# Altium project DCAR_Adapter.PrjPcb
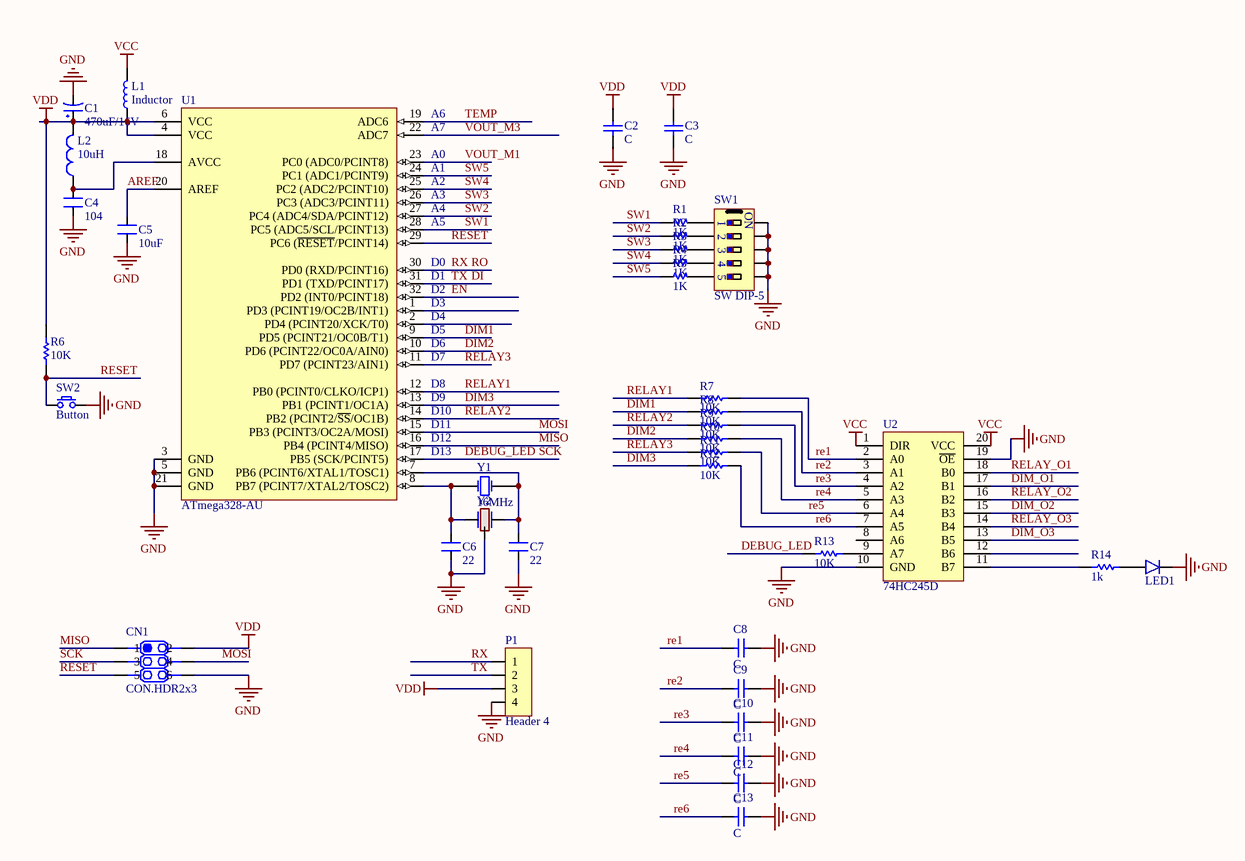
[diagram p0: Sheet2.SchDoc]
4 sheets, 133 parts. Net scope: global (net labels, ports and power ports of the same name join across sheets).
Board file: PCB2.PcbDoc
Sheets:
  Sheet2.SchDoc
  Sheet3.SchDoc
  Sheet4.SchDoc
  Sheet5.SchDoc

## Sheet Sheet2.SchDoc
size A3

### Parts
C1  470uF/16V  [WCAP-PSHP 8x8.7x3.1]
C2  C  [C 0805 (2012)]
C3  C  [C 0805 (2012)]
C4  104  [R 0805 (2012)]
C5  10uF  [R 0805 (2012)]
C6  22  [C 0805 (2012)]
C7  22  [C 0805 (2012)]
C8  C  [C 0805]
C9  C  [C 0805]
C10  C  [C 0805]
C11  C  [C 0805]
C12  C  [C 0805]
C13  C  [C 0805]
CN1  CON.HDR2x3  [Header 3x2]
L1  Inductor  [Inductor SMD 0805 (2012)]
L2  10uH  [R 0805 (2012)]
LED1  Led  [Led SMD 0805]  (value not drawn)
P1  Header 4  [Header 4]
R1  1K  [R 0805]
R2  1K  [R 0805]
R3  1K  [R 0805]
R4  1K  [R 0805]
R5  1K  [R 0805]
R6  10K  [R 0805 (2012)]
R7  10K  [R 0805 (2012)]
R8  10K  [R 0805 (2012)]
R9  10K  [R 0805 (2012)]
R10  10K  [R 0805 (2012)]
R11  10K  [R 0805 (2012)]
R12  10K  [R 0805 (2012)]
R13  10K  [R 0805 (2012)]
R14  1k  [R 0805 (2012)]
SW1  SW DIP-5  [SW/DIP5/300]
SW2  Button  [SW/2/SMD]
U1  ATmega328-AU  [QFP32N]
U2  74HC245D  [SOIC-20]
Y1  16MHz  [XTAL]
Y2  (no value)  [Crystal SMD CSTCE]

### Nets
GND: C1.2 C2.2 C3.2 C4.1 C5.1 C6.1 C7.1 C8.2 C9.2 C10.2 C11.2 C12.2 C13.2 CN1.6 LED1.2(K) P1.4 SW1.6 SW1.7 SW1.8 SW1.9 SW1.10 SW2.2 U1.3(GND) U1.5(GND) U1.21(GND) U2.10(GND) U2.19(~{OE}) Y2.2
VCC: L1.2 U2.1(DIR) U2.20(VCC)  [project net 5V]
VDD: C1.1 C2.1 C3.1 CN1.2 L1.1 L2.2 P1.3 R6.2 U1.4(VCC) U1.6(VCC)
AREF: C5.2 U1.20(AREF)
DEBUG_LED: CN1.3 R13.1 U1.17(PB5_(SCK/PCINT5))  [also labelled SCK]
DI: P1.2 U1.31(PD1_(TXD/PCINT17))  [also labelled TX]
DIM1: R8.1 U1.9(PD5_(PCINT21/OC0B/T1))
DIM2: R10.1 U1.10(PD6_(PCINT22/OC0A/AIN0))
DIM3: R12.1 U1.13(PB1_(PCINT1/OC1A))
DIM_O1: U2.17(B1)
DIM_O2: U2.15(B3)
DIM_O3: U2.13(B5)
EN: U1.32(PD2_(INT0/PCINT18))
MISO: CN1.1 U1.16(PB4_(PCINT4/MISO))
MOSI: CN1.4 U1.15(PB3_(PCINT3/OC2A/MOSI))
re1: C8.1 R7.2 U2.2(A0)
re2: C9.1 R8.2 U2.3(A1)
re3: C10.1 R9.2 U2.4(A2)
re4: C11.1 R10.2 U2.5(A3)
re5: C12.1 R11.2 U2.6(A4)
re6: C13.1 R12.2 U2.7(A5)
RELAY1: R7.1 U1.12(PB0_(PCINT0/CLKO/ICP1))
RELAY2: R9.1 U1.14(PB2_(PCINT2/~{SS}/OC1B))
RELAY3: R11.1 U1.11(PD7_(PCINT23/AIN1))
RELAY_O1: U2.18(B0)
RELAY_O2: U2.16(B2)
RELAY_O3: U2.14(B4)
RESET: CN1.5 R6.1 SW2.1 U1.29(PC6_(~{RESET}/PCINT14))
RO: P1.1 U1.30(PD0_(RXD/PCINT16))  [also labelled RX]
SW1: R1.1 U1.28(PC5_(ADC5/SCL/PCINT13))
SW2: R2.1 U1.27(PC4_(ADC4/SDA/PCINT12))
SW3: R3.1 U1.26(PC3_(ADC3/PCINT11))
SW4: R4.1 U1.25(PC2_(ADC2/PCINT10))
SW5: R5.1 U1.24(PC1_(ADC1/PCINT9))
TEMP: U1.19(ADC6)
VOUT_M1: U1.23(PC0_(ADC0/PCINT8))
VOUT_M3: U1.22(ADC7)
NetC4_2: C4.2 L2.1 U1.18(AVCC)
NetC6_2: C6.2 U1.8(PB7_(PCINT7/XTAL2/TOSC2)) Y1.1(OSC1) Y2.3
NetC7_2: C7.2 U1.7(PB6_(PCINT6/XTAL1/TOSC1)) Y1.2(OSC2) Y2.1
NetLED1_1: LED1.1(A) R14.2
NetR1_2: R1.2 SW1.1
NetR2_2: R2.2 SW1.2
NetR3_2: R3.2 SW1.3
NetR4_2: R4.2 SW1.4
NetR5_2: R5.2 SW1.5
NetR13_2: R13.2 U2.9(A7)
NetR14_1: R14.1 U2.11(B7)

Not connected (* = marked no-connect by the designer): U1 1(PD3_(PCINT19/OC2B/INT1)) 2(PD4_(PCINT20/XCK/T0)); U2 8(A6) 12(B6)

### Notes on the sheet
- (near U1) A6
- (near U1) A0
- (near U1) A1
- (near U1) A2
- (near U1) A7
- (near U1) A3
- (near U1) A4
- (near U1) A5
- (near U1) D2
- (near U1) D3
- (near U1) D4
- (near U1) D0
- (near U1) D1
- (near U1) D7
- (near U1) D8
- (near U1) D5
- (near U1) D6
- (near U1) D9
- (near U1) D10
- (near U1) D11
- D12
- D13
- (in symbol SW DIP-5) ON

### Library data of the parts
C1 = CP4: Cap 1000uF/16V - 220uF/50V; Description 5: 4,7uF>10uF/250V_3,3uF>10uF/400V - 2,2uF>4,7uF/450V; Description 1: 2200uF-3300uF/6,3V - 1000uF-2200uF/10V; Description 2: 1000uF/16V - 470uF => 1000uF/25V - 100uF/100V; Description 3: 330uF>470uF/35V_220uF>470uF/50V_10uF>22uF/250V; Description 4: 220uF => 330uF/63V - 10uF =>33uF/160 - 200V; Value: 1000uF/16V
C2 C3 C8-C13 = Capacitor NP: Capacitor non-pol
C4 C6 C7 = CN2: Cap np 104 => 105pF; Value: 0.1uF
C5 = CN1: Cap np  1pF - 472pF; Value: 100pF
CN1 = CON.HDR2x3: Header 2x3; Publisher: Hoang Nguyen; ComponentLink1Description: Digikey Part link; ComponentLink2Description: Open DataSheet; ComponentLink2URL: H:\LIBRARY\LIBRARY.Datasheet\
L2 = L1: Inductor; Value: 150 mH
LED1 = Led: Typical LED
P1 = Header 4: Header, 4-Pin
R1-R14 = Resistor
  R6: Published: 8-Jun-2000; LatestRevisionDate: 17-Jul-2002; LatestRevisionNote: Re-released for DXP Platform.; PackageReference: AXIAL-0.3; Publisher: Altium Limited; Value: 10K
  R7-R14: Published: 8-Jun-2000; LatestRevisionDate: 17-Jul-2002; LatestRevisionNote: Re-released for DXP Platform.; PackageReference: AXIAL-0.3; Publisher: Altium Limited
SW2 = SW SPST: Tact switch 2 pin
U1 = ATmega328-AU: 8-bit AVR Microcontroller, 32KB Flash, 1KB EEPROM, 2KB SRAM, 32-pin TQFP, Industrial Grade (-40°C to 85°C); Published: 1-Apr-2010; DatasheetVersion: revA, Jan-2010; PackageVersion: revB, Oct-2001; PackageReference: 32A; Publisher: Altium Limited; PackageDescription: 32-Lead, 7x7x1.0 mm Body, 0.8mm Lead Pitch, Thin Profile Plastic Quad Flat Package (TQFP); Supplier 1: Digi-Key; Supplier Part Number 1: ATMEGA328-AU-ND; Supplier 2: Mouser; Supplier Part Number 2: 556-ATMEGA328-AU; Code_JEDEC: MS-026-ABA; ComponentLink1Description: Manufacturer Link; ComponentLink1URL: http://www.atmel.com/products/avr/default.asp?; ComponentLink2Description: ATmega48A/48PA/88A/88PA/168A/168PA/328/328P Datasheet; ComponentLink2URL: http://www.atmel.com/dyn/resources/prod_documents/8271.pdf; ComponentLink3Description: ATmega48A/48PA/88A/88PA/168A/168PA/328/328P Summary; ComponentLink3URL: http://www.atmel.com/dyn/resources/prod_documents/8271S.pdf; ComponentLink4Description: Atmel.com Home; ComponentLink4URL: http://www.atmel.com
U2 = 74HC245D: IC TRANSCVR NON-INVERT 6V 20SO
Y1 = XTAL: Crystal Oscillator; Published: 8-Jun-2000; LatestRevisionDate: 17-Jul-2002; LatestRevisionNote: Re-released for DXP Platform.; PackageReference: R38; Publisher: Altium Limited
Y2 = Crystal CSTCE

## Sheet Sheet3.SchDoc
size A
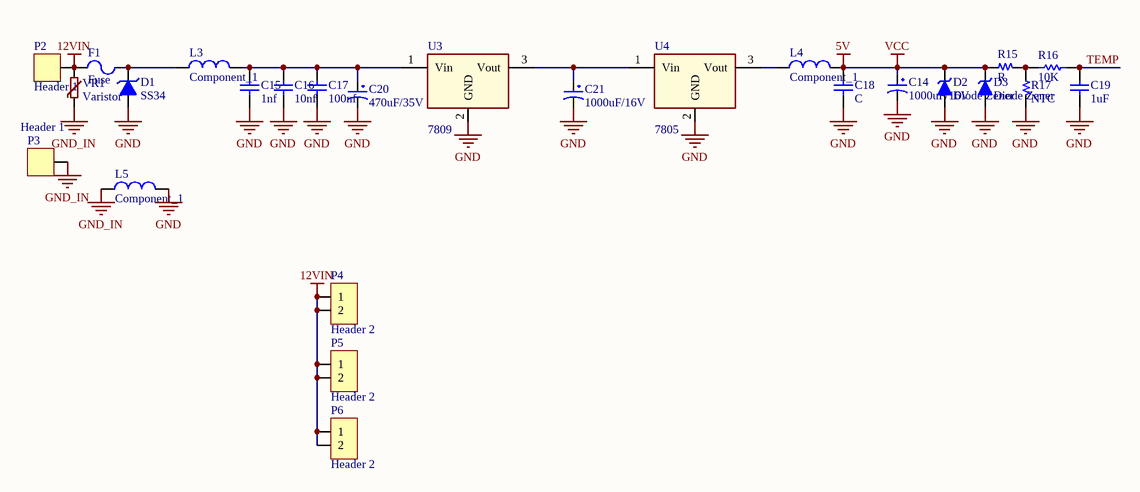
[diagram p1: Sheet3.SchDoc]

### Parts
C14  1000uF/16V  [WCAP-PSHP 8x8.7x3.1]
C15  1nf  [C 0805 (2012)]
C16  10nf  [C 0805 (2012)]
C17  100nf  [C 0805 (2012)]
C18  C  [C 0805 (2012)]
C19  1uF  [C 0805 (2012)]
C20  470uF/35V  [WCAP-PSHP 8x8.7x3.1]
C21  1000uF/16V  [WCAP-PSHP 8x8.7x3.1]
D1  SS34  [DO-214AC (SMA)]
D2  Diode Zener  [SOD-80]
D3  Diode Zener  [SOD-80]
F1  Fuse  [DCAR Fuse holder]
L3  Component_1  [1210]
L4  Component_1  [Inductor SMD 4.8x4.8]
L5  Component_1  [1210]
P2  Header 1  [HDR/Terminal/1/copper/8.8]
P3  Header 1  [HDR/Terminal/1/copper/8.8]
P4  Header 2  [HDR Domino 2]
P5  Header 2  [HDR Domino 2]
P6  Header 2  [HDR Domino 2]
R15  R  [R 0805]
R16  10K  [R 0805 (2012)]
R17  NTC  [R 1/4W/300]
U3  7809  [TO-252 (DPAK)]
U4  7805  [TO-252 (DPAK)]
VR1  Varistor  [VARISTOR DISC 5MM/7MM]

### Nets
5V: C14.1 C18.1 D2.2(K) D3.2(K) L4.2 R15.1  [also labelled VCC]
12VIN: F1.1 P2.1 P4.1 P4.2 P5.1 P5.2 P6.1 P6.2 VR1.1
GND: C14.2 C15.2 C16.2 C17.2 C18.2 C19.2 C20.2 C21.2 D1.1(A) D2.1(A) D3.1(A) L5.2 R17.2 U3.2(GND) U4.2(GND)
GND_IN: L5.1 P3.1 VR1.2
TEMP: C19.1 R16.2
NetC15_1: C15.1 C16.1 C17.1 C20.1 L3.2 U3.1(Vin)
NetC21_1: C21.1 U3.3(Vout) U4.1(Vin)
NetD1_2: D1.2(K) F1.2 L3.1
NetL4_1: L4.1 U4.3(Vout)
NetR15_2: R15.2 R16.1 R17.1

### Library data of the parts
C14 C21 = CP4: as C1 on sheet Sheet2; Value: 1000uF/16V
C15-C19 = Capacitor NP: Capacitor non-pol
C20 = CP3: Cap 100uF/35V - 470uF/16V; Value: 100uF/35V/50V; Description 1: 1000uF/6,3V - 470uF/16V - 330uF - 25V; Description 2: 220uF/35V - 100uF/50V - 63V - 4,7uF/200V; Description 3: 22uF => 33uF100V - 3,3uF => 4,7uF/250V; Description 4: 2,2uF =>3,3uF/350 - 2,2uF/400V - 1uF/450V
D1 = Zener
D2 D3 = Diode Zener: Zener Diode; Published: 8-Jun-2000; LatestRevisionDate: 17-Jul-2002; LatestRevisionNote: Re-released for DXP Platform.; PackageReference: DIODE-0.7; Publisher: Altium Limited
P2 P3 = Header 1: Header, 1-Pin
P4-P6 = Header 2: Header, 2-Pin; LatestRevisionDate: 17-Jul-2002; LatestRevisionNote: Re-released for DXP Platform.; Publisher: Altium Limited
R15-R17 = Resistor
  R16: Published: 8-Jun-2000; LatestRevisionDate: 17-Jul-2002; LatestRevisionNote: Re-released for DXP Platform.; PackageReference: AXIAL-0.3; Publisher: Altium Limited
U3 U4 = 78xx: LDO Fixed Voltage regulator

## Sheet Sheet4.SchDoc
size A
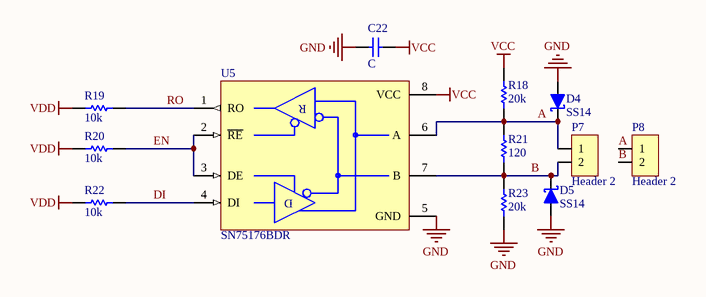
[diagram p2: Sheet4.SchDoc]

### Parts
C22  C  [C 0805 (2012)]
D4  SS14  [DO-214AC (SMA)]
D5  SS14  [DO-214AC (SMA)]
P7  Header 2  [HDR Domino 2]
P8  Header 2  [HDR Domino 2]
R18  20k  [R 0805 (2012)]
R19  10k  [R 0805 (2012)]
R20  10k  [R 0805 (2012)]
R21  120  [R 0805 (2012)]
R22  10k  [R 0805 (2012)]
R23  20k  [R 0805 (2012)]
U5  SN75176BDR  [SOIC-8]

### Nets
GND: C22.2 D4.1(A) D5.1(A) R23.1 U5.5(GND)
VCC: C22.1 R18.2 U5.8(VCC)  [project net 5V]
VDD: R19.2 R20.2 R22.2
A: D4.2(K) P7.1 P8.1 R18.1 R21.2 U5.6(A)
B: D5.2(K) P7.2 P8.2 R21.1 R23.2 U5.7(B)
DI: R22.1 U5.4(DI)
EN: R20.1 U5.2(~{RE}) U5.3(DE)
RO: R19.1 U5.1(RO)

### Notes on the sheet
- (in symbol MAX485) R; D

### Library data of the parts
C22 = Capacitor NP: Capacitor non-pol
D4 D5 = Diode Schottky: Schottky Diode; Published: 8-Jun-2000; LatestRevisionDate: 17-Jul-2002; LatestRevisionNote: Re-released for DXP Platform.; PackageReference: SMB; Publisher: Altium Limited; Code_JEDEC: DO-214-AA
P7 P8 = Header 2: Header, 2-Pin; LatestRevisionDate: 17-Jul-2002; LatestRevisionNote: Re-released for DXP Platform.; Publisher: Altium Limited
R18-R23 = Resistor: Published: 8-Jun-2000; LatestRevisionDate: 17-Jul-2002; LatestRevisionNote: Re-released for DXP Platform.; PackageReference: AXIAL-0.3; Publisher: Altium Limited
U5 = MAX485

## Sheet Sheet5.SchDoc
size A4
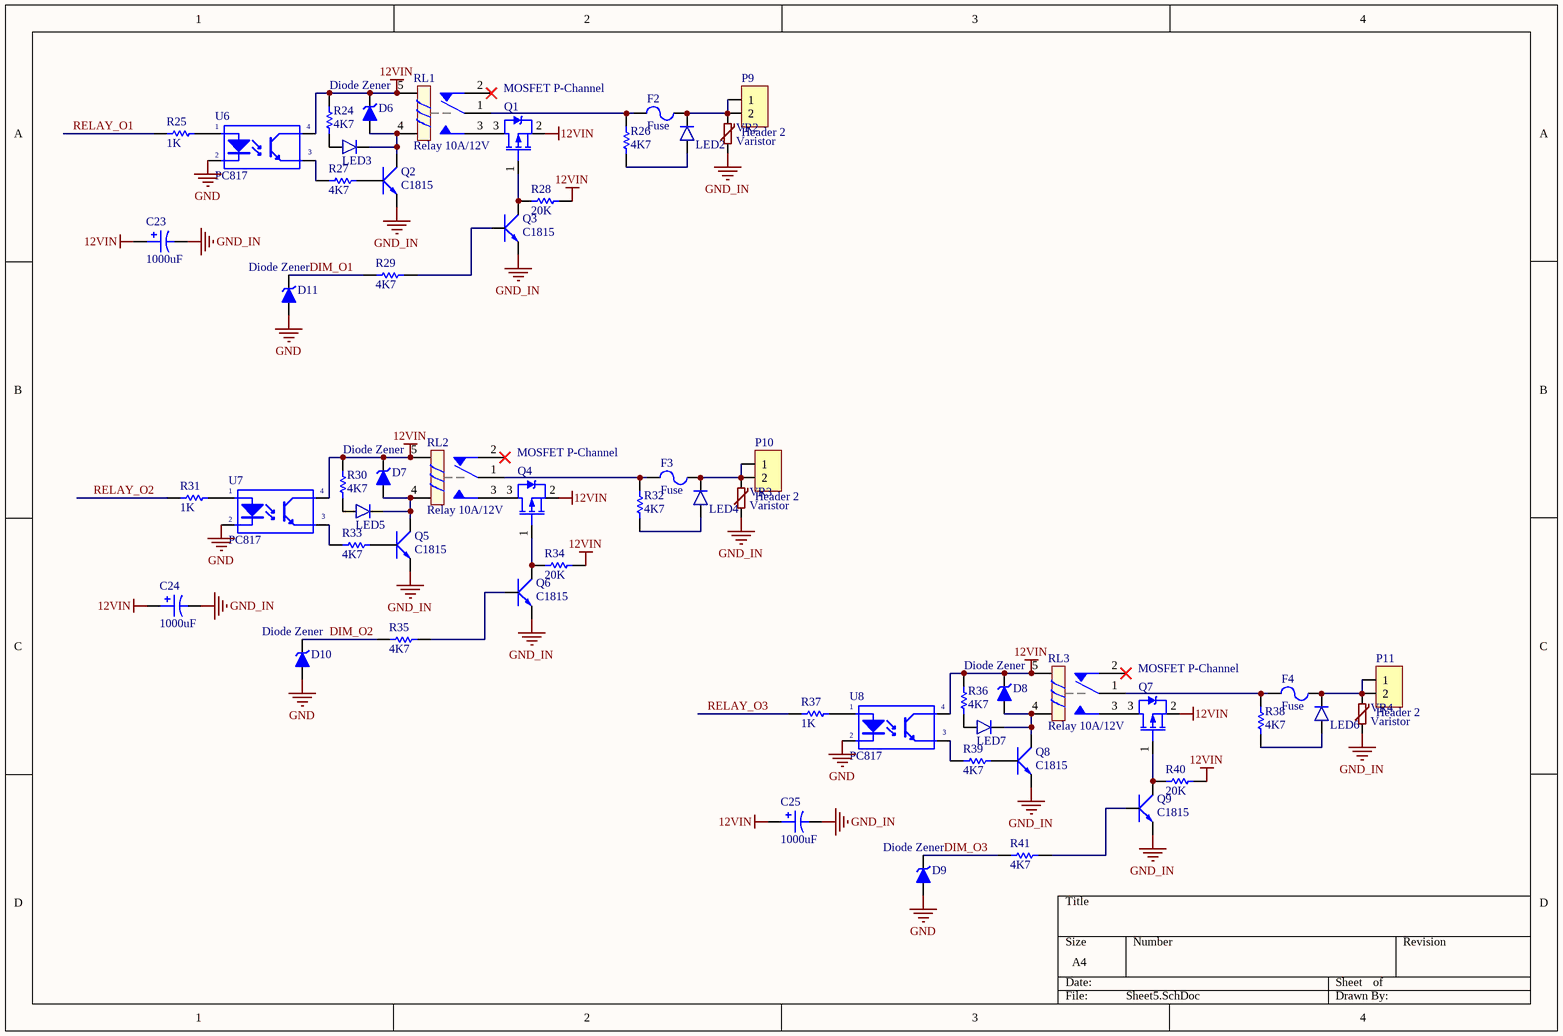
[diagram p3: Sheet5.SchDoc]

### Parts
C23  value 1000uF  [RADIAL E]  (hidden comment: Cap Pol)
C24  value 1000uF  [RADIAL E]  (hidden comment: Cap Pol)
C25  value 1000uF  [RADIAL E]  (hidden comment: Cap Pol)
D6  Diode Zener  [SOD-80]
D7  Diode Zener  [SOD-80]
D8  Diode Zener  [SOD-80]
D9  Diode Zener  [SOD-80]
D10  Diode Zener  [SOD-80]
D11  Diode Zener  [SOD-80]
F2  Fuse  [DCAR Fuse holder]
F3  Fuse  [DCAR Fuse holder]
F4  Fuse  [DCAR Fuse holder]
LED2  Led  [Led SMD 0805]  (value not drawn)
LED3  Led  [Led SMD 0805]  (value not drawn)
LED4  Led  [Led SMD 0805]  (value not drawn)
LED5  Led  [Led SMD 0805]  (value not drawn)
LED6  Led  [Led SMD 0805]  (value not drawn)
LED7  Led  [Led SMD 0805]  (value not drawn)
P9  Header 2  [HDR Domino 2]
P10  Header 2  [HDR Domino 2]
P11  Header 2  [HDR Domino 2]
Q1  MOSFET P-Channel  [TO-252 (DPAK)]
Q2  C1815  [SOT23B]
Q3  C1815  [SOT23B]
Q4  MOSFET P-Channel  [TO-252 (DPAK)]
Q5  C1815  [SOT23B]
Q6  C1815  [SOT23B]
Q7  MOSFET P-Channel  [TO-252 (DPAK)]
Q8  C1815  [SOT23B]
Q9  C1815  [SOT23B]
R24  4K7  [R 0805 (2012)]
R25  1K  [R 0805 (2012)]
R26  4K7  [R 0805 (2012)]
R27  4K7  [R 0805 (2012)]
R28  20K  [R 0805 (2012)]
R29  4K7  [R 0805 (2012)]
R30  4K7  [R 0805 (2012)]
R31  1K  [R 0805 (2012)]
R32  4K7  [R 0805 (2012)]
R33  4K7  [R 0805 (2012)]
R34  20K  [R 0805 (2012)]
R35  4K7  [R 0805 (2012)]
R36  4K7  [R 0805 (2012)]
R37  1K  [R 0805 (2012)]
R38  4K7  [R 0805 (2012)]
R39  4K7  [R 0805 (2012)]
R40  20K  [R 0805 (2012)]
R41  4K7  [R 0805 (2012)]
RL1  Relay 10A/12V  [RL_SPDT_10A]
RL2  Relay 10A/12V  [RL_SPDT_10A]
RL3  Relay 10A/12V  [RL_SPDT_10A]
U6  PC817  [SOP4 - PC817]
U7  PC817  [SOP4 - PC817]
U8  PC817  [SOP4 - PC817]
VR2  Varistor  [VARISTOR DISC 5MM/7MM]
VR3  Varistor  [VARISTOR DISC 5MM/7MM]
VR4  Varistor  [VARISTOR DISC 5MM/7MM]

### Nets
12VIN: C23.1 C24.1 C25.1 D6.2(K) D7.2(K) D8.2(K) Q1.2(S) Q4.2(S) Q7.2(S) R24.2 R28.2 R30.2 R34.2 R36.2 R40.2 RL1.5 RL2.5 RL3.5 U6.4(C) U7.4(C) U8.4(C)
GND: D9.1(A) D10.1(A) D11.1(A) U6.2(K) U7.2(K) U8.2(K)
GND_IN: C23.2 C24.2 C25.2 Q2.1(E) Q3.1(E) Q5.1(E) Q6.1(E) Q8.1(E) Q9.1(E) VR2.1 VR3.1 VR4.1
DIM_O1: D11.2(K) R29.1
DIM_O2: D10.2(K) R35.1
DIM_O3: D9.2(K) R41.1
RELAY_O1: R25.2
RELAY_O2: R31.2
RELAY_O3: R37.2
NetD6_1: D6.1(A) LED3.2(K) Q2.2(C) RL1.4
NetD7_1: D7.1(A) LED5.2(K) Q5.2(C) RL2.4
NetD8_1: D8.1(A) LED7.2(K) Q8.2(C) RL3.4
NetF2_1: F2.1 R26.2 RL1.1
NetF2_2: F2.2 LED2.2(K) P9.1 P9.2 VR2.2
NetF3_1: F3.1 R32.2 RL2.1
NetF3_2: F3.2 LED4.2(K) P10.1 P10.2 VR3.2
NetF4_1: F4.1 R38.2 RL3.1
NetF4_2: F4.2 LED6.2(K) P11.1 P11.2 VR4.2
NetLED2_1: LED2.1(A) R26.1
NetLED3_1: LED3.1(A) R24.1
NetLED4_1: LED4.1(A) R32.1
NetLED5_1: LED5.1(A) R30.1
NetLED6_1: LED6.1(A) R38.1
NetLED7_1: LED7.1(A) R36.1
NetQ1_1: Q1.1(G) Q3.2(C) R28.1
NetQ1_3: Q1.3(D) RL1.3
NetQ2_3: Q2.3(B) R27.2
NetQ3_3: Q3.3(B) R29.2
NetQ4_1: Q4.1(G) Q6.2(C) R34.1
NetQ4_3: Q4.3(D) RL2.3
NetQ5_3: Q5.3(B) R33.2
NetQ6_3: Q6.3(B) R35.2
NetQ7_1: Q7.1(G) Q9.2(C) R40.1
NetQ7_3: Q7.3(D) RL3.3
NetQ8_3: Q8.3(B) R39.2
NetQ9_3: Q9.3(B) R41.2
NetR25_1: R25.1 U6.1(A)
NetR27_1: R27.1 U6.3(E)
NetR31_1: R31.1 U7.1(A)
NetR33_1: R33.1 U7.3(E)
NetR37_1: R37.1 U8.1(A)
NetR39_1: R39.1 U8.3(E)

Not connected (* = marked no-connect by the designer): RL1 2*; RL2 2*; RL3 2*

### Library data of the parts
C23-C25 = Cap Pol: Polarized Capacitor; Published: 8-Jun-2000; LatestRevisionDate: 17-Jul-2002; LatestRevisionNote: Re-released for DXP Platform.; PackageReference: POLAR0.8; Publisher: Altium Limited
D6-D11 = Diode Zener: Zener Diode; Published: 8-Jun-2000; LatestRevisionDate: 17-Jul-2002; LatestRevisionNote: Re-released for DXP Platform.; PackageReference: DIODE-0.7; Publisher: Altium Limited
LED2-LED7 = Led: Typical LED
P9-P11 = Header 2: Header, 2-Pin; LatestRevisionDate: 17-Jul-2002; LatestRevisionNote: Re-released for DXP Platform.; Publisher: Altium Limited
Q1 Q4 Q7 = MOSFET P-Channel: pin to pad: 2>3 3>2
Q2 Q3 Q5 Q6 Q8 Q9 = C1815: NPN 600mW, ECB; Value: C1815
R24-R41 = Resistor: Published: 8-Jun-2000; LatestRevisionDate: 17-Jul-2002; LatestRevisionNote: Re-released for DXP Platform.; PackageReference: AXIAL-0.3; Publisher: Altium Limited
RL1-RL3 = Relay 1: Relay SPDT,10A - 12VDC 5 Pin; Value: Relay SPDT, 10A, 12V
U6-U8 = PC817: Single Opto; Value: PC817

## Nets that join several sheets
5V: Sheet2 (L1.2 U2.1 U2.20), Sheet3 (6 pins), Sheet4 (C22.1 R18.2 U5.8)
12VIN: Sheet3 (9 pins), Sheet5 (21 pins)
GND: Sheet2 (28 pins), Sheet3 (15 pins), Sheet4 (5 pins), Sheet5 (6 pins)
GND_IN: Sheet3 (L5.1 P3.1 VR1.2), Sheet5 (12 pins)
VDD: Sheet2 (10 pins), Sheet4 (R19.2 R20.2 R22.2)
DI: Sheet2 (P1.2 U1.31), Sheet4 (R22.1 U5.4)
DIM_O1: Sheet2 (U2.17), Sheet5 (D11.2 R29.1)
DIM_O2: Sheet2 (U2.15), Sheet5 (D10.2 R35.1)
DIM_O3: Sheet2 (U2.13), Sheet5 (D9.2 R41.1)
EN: Sheet2 (U1.32), Sheet4 (R20.1 U5.2 U5.3)
RELAY_O1: Sheet2 (U2.18), Sheet5 (R25.2)
RELAY_O2: Sheet2 (U2.16), Sheet5 (R31.2)
RELAY_O3: Sheet2 (U2.14), Sheet5 (R37.2)
RO: Sheet2 (P1.1 U1.30), Sheet4 (R19.1 U5.1)
TEMP: Sheet2 (U1.19), Sheet3 (C19.1 R16.2)